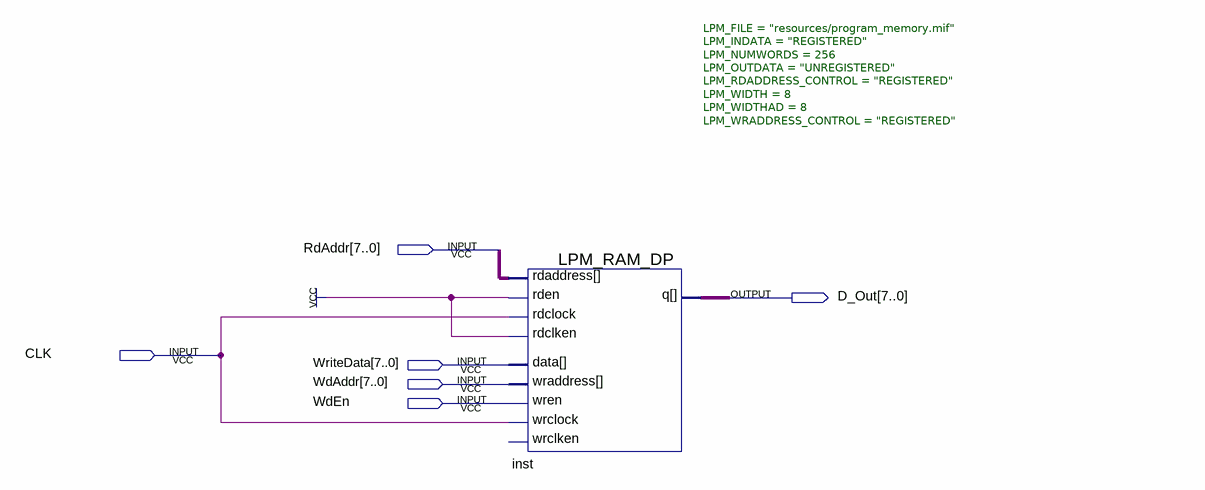
[diagram p0: schematic sheet]
// Quartus schematic program_memory.bdf as structural Verilog: 1 symbols, 6 pins
module program_memory (
  input  [7:0] RdAddr,
  input  CLK,
  input  [7:0] WriteData,
  input  [7:0] WdAddr,
  input  WdEn,
  output [7:0] D_Out
);

  LPM_RAM_DP #(.LPM_FILE("resources/program_memory.mif"), .LPM_INDATA("REGISTERED"), .LPM_NUMWORDS(256), .LPM_OUTDATA("UNREGISTERED"), .LPM_RDADDRESS_CONTROL("REGISTERED"), .LPM_WIDTH(8), .LPM_WIDTHAD(8), .LPM_WRADDRESS_CONTROL("REGISTERED")) inst (
    .rden(1'b1), .rdclock(CLK), .rdclken(1'b1), .wren(WdEn), .wrclock(CLK), .rdaddress(RdAddr),
    .data(WriteData), .wraddress(WdAddr), .q(D_Out));  // open: wrclken
endmodule
